# EAGLE schematic cnc-power-panel (EAGLE 7.3.0)
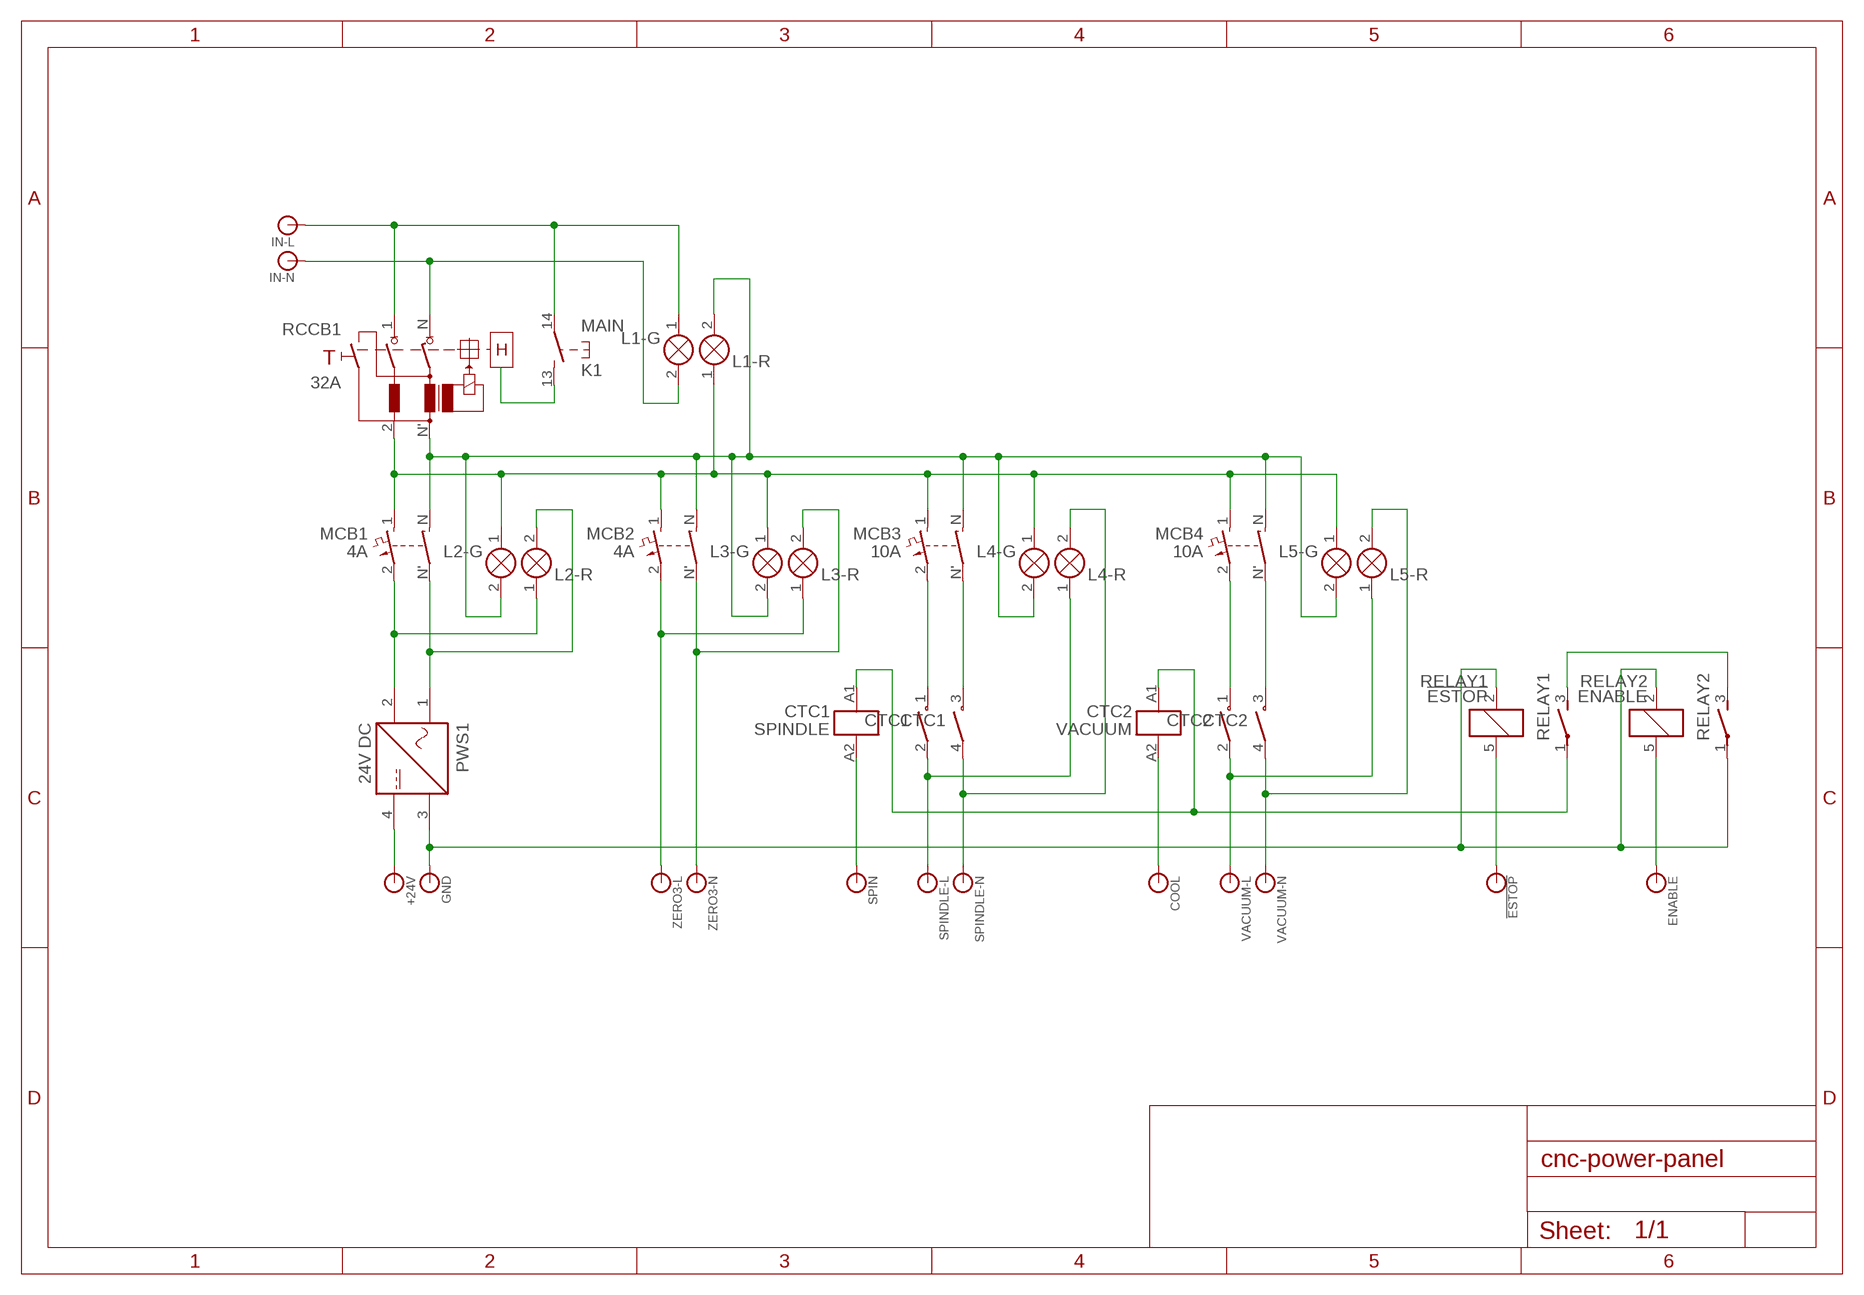
[diagram p0: schematic, sheet 1]

## Parts
!ESTOP  BANANA_CONN  [BANANA_CONN]
+24V  BANANA_CONN  [BANANA_CONN]
COOL  BANANA_CONN  [BANANA_CONN]
CTC1  SPINDLE  HAUPTSCHUETZ_2-POL  [HAUPTSCHUETZ_2-POL]
CTC2  VACUUM  HAUPTSCHUETZ_2-POL  [HAUPTSCHUETZ_2-POL]
ENABLE  BANANA_CONN  [BANANA_CONN]
GND  BANANA_CONN  [BANANA_CONN]
IN-L  BANANA_CONN  [BANANA_CONN]
IN-N  BANANA_CONN  [BANANA_CONN]
K1  MAIN  TASTER_SCHLIESSER  [EINTASTER]
L1-G  SIGNALLAMPE  [LAMPE]
L1-R  SIGNALLAMPE  [LAMPE]
L2-G  SIGNALLAMPE  [LAMPE]
L2-R  SIGNALLAMPE  [LAMPE]
L3-G  SIGNALLAMPE  [LAMPE]
L3-R  SIGNALLAMPE  [LAMPE]
L4-G  SIGNALLAMPE  [LAMPE]
L4-R  SIGNALLAMPE  [LAMPE]
L5-G  SIGNALLAMPE  [LAMPE]
L5-R  SIGNALLAMPE  [LAMPE]
MCB1  4A  LEITUNGSSCHUTZSCHALTER_2-POL  [LEITUNGSSCHUTZSCHALTER_2-POL]
MCB2  4A  LEITUNGSSCHUTZSCHALTER_2-POL  [LEITUNGSSCHUTZSCHALTER_2-POL]
MCB3  10A  LEITUNGSSCHUTZSCHALTER_2-POL  [LEITUNGSSCHUTZSCHALTER_2-POL]
MCB4  10A  LEITUNGSSCHUTZSCHALTER_2-POL  [LEITUNGSSCHUTZSCHALTER_2-POL]
PWS1  24V DC  NETZTEIL_GLEICHSPANNUNG  [NETZTEIL_GLEICHSPANNUNG]
RCCB1  32A  FEHLER-STROM-SCHUTZSCHALTER_2-POL  [FEHLER-STROM-SCHUTZSCHALTER_2-POL]
RELAY1  !ESTOP  AZ8-FORM-A  [AZ8]
RELAY2  ENABLE  AZ8-FORM-A  [AZ8]
SPIN  BANANA_CONN  [BANANA_CONN]
SPINDLE-L  BANANA_CONN  [BANANA_CONN]
SPINDLE-N  BANANA_CONN  [BANANA_CONN]
VACUUM-L  BANANA_CONN  [BANANA_CONN]
VACUUM-N  BANANA_CONN  [BANANA_CONN]
ZERO3-L  BANANA_CONN  [BANANA_CONN]
ZERO3-N  BANANA_CONN  [BANANA_CONN]

## Nets
N$1: IN-N.P$1 L1-G.2(X2) RCCB1.N
N$2: IN-L.P$1 K1.14 L1-G.1(X1) RCCB1.1
N$3: K1.13
N$4: !ESTOP.P$1 RELAY1.5
N$5: L2-R.1(X1) MCB1.2 PWS1.2
N$6: L2-R.2(X2) MCB1.N'(N) PWS1.1
N$8: +24V.P$1 PWS1.4
N$9: CTC1.1 MCB3.2
N$10: CTC1.4 L4-R.2(X2) SPINDLE-N.P$1
N$11: L3-R.1(X1) MCB2.2 ZERO3-L.P$1
N$12: L3-R.2(X2) MCB2.N'(N) ZERO3-N.P$1
N$13: CTC1.2 L4-R.1(X1) SPINDLE-L.P$1
N$14: CTC1.3 MCB3.N'(N)
N$15: L1-R.1(X1) L2-G.1(X1) L3-G.1(X1) L4-G.1(X1) L5-G.1(X1) MCB1.1 MCB2.1 MCB3.1 MCB4.1 RCCB1.2
N$16: RELAY1.3(-1:S) RELAY2.3(-1:S)
N$17: CTC1.A2(1:A2) SPIN.P$1
N$18: CTC1.A1(1:A1) CTC2.A1(1:A1) RELAY1.1(-1:P)
N$19: CTC2.1 MCB4.2
N$20: CTC2.4 L5-R.2(X2) VACUUM-N.P$1
N$21: CTC2.2 L5-R.1(X1) VACUUM-L.P$1
N$22: CTC2.3 MCB4.N'(N)
N$23: COOL.P$1 CTC2.A2(1:A2)
N$24: L1-R.2(X2) L2-G.2(X2) L3-G.2(X2) L4-G.2(X2) L5-G.2(X2) MCB1.N MCB2.N MCB3.N MCB4.N RCCB1.N'
N$25: ENABLE.P$1 RELAY2.5
N$27: GND.P$1 PWS1.3 RELAY1.2 RELAY2.1(-1:P) RELAY2.2

## Library data of the parts
!ESTOP +24V COOL ENABLE GND IN-L IN-N SPIN SPINDLE-L SPINDLE-N VACUUM-L VACUUM-N ZERO3-L ZERO3-N = SparkFun-Connectors:BANANA_CONN: Through-hole banana jack
CTC1 CTC2 = e-schuetze-relais:HAUPTSCHUETZ_2-POL: Hauptschütz mit 2 Schließern
K1 = e-schalter:TASTER_SCHLIESSER: Ein-Taster (Arbeitskontakt)
L1-G L1-R L2-G L2-R L3-G L3-R L4-G L4-R L5-G L5-R = e-lampen-signalisation:SIGNALLAMPE: Lampe
MCB1-MCB4 = e-sicherungen:LEITUNGSSCHUTZSCHALTER_2-POL: Leitungsschutzschalter, 2-pol.
PWS1 = e-stromversorgungselemente:NETZTEIL_GLEICHSPANNUNG: Netzteil, Gleichspannung
RCCB1 = e-sicherungen:FEHLER-STROM-SCHUTZSCHALTER_2-POL: Fehlerstromschutzschalter (FI) 2-pol mit Prüftaste
RELAY1 RELAY2 = relay:AZ8-FORM-A: MINIATURE PC BOARD RELAY Form A Source: www.azettler.com .. AZ8-1ch-12DSE.PDF; OC_FARNELL: unknown; OC_NEWARK: unknown